# EAGLE design Transistor Tester v3 (EAGLE 6.5.0)
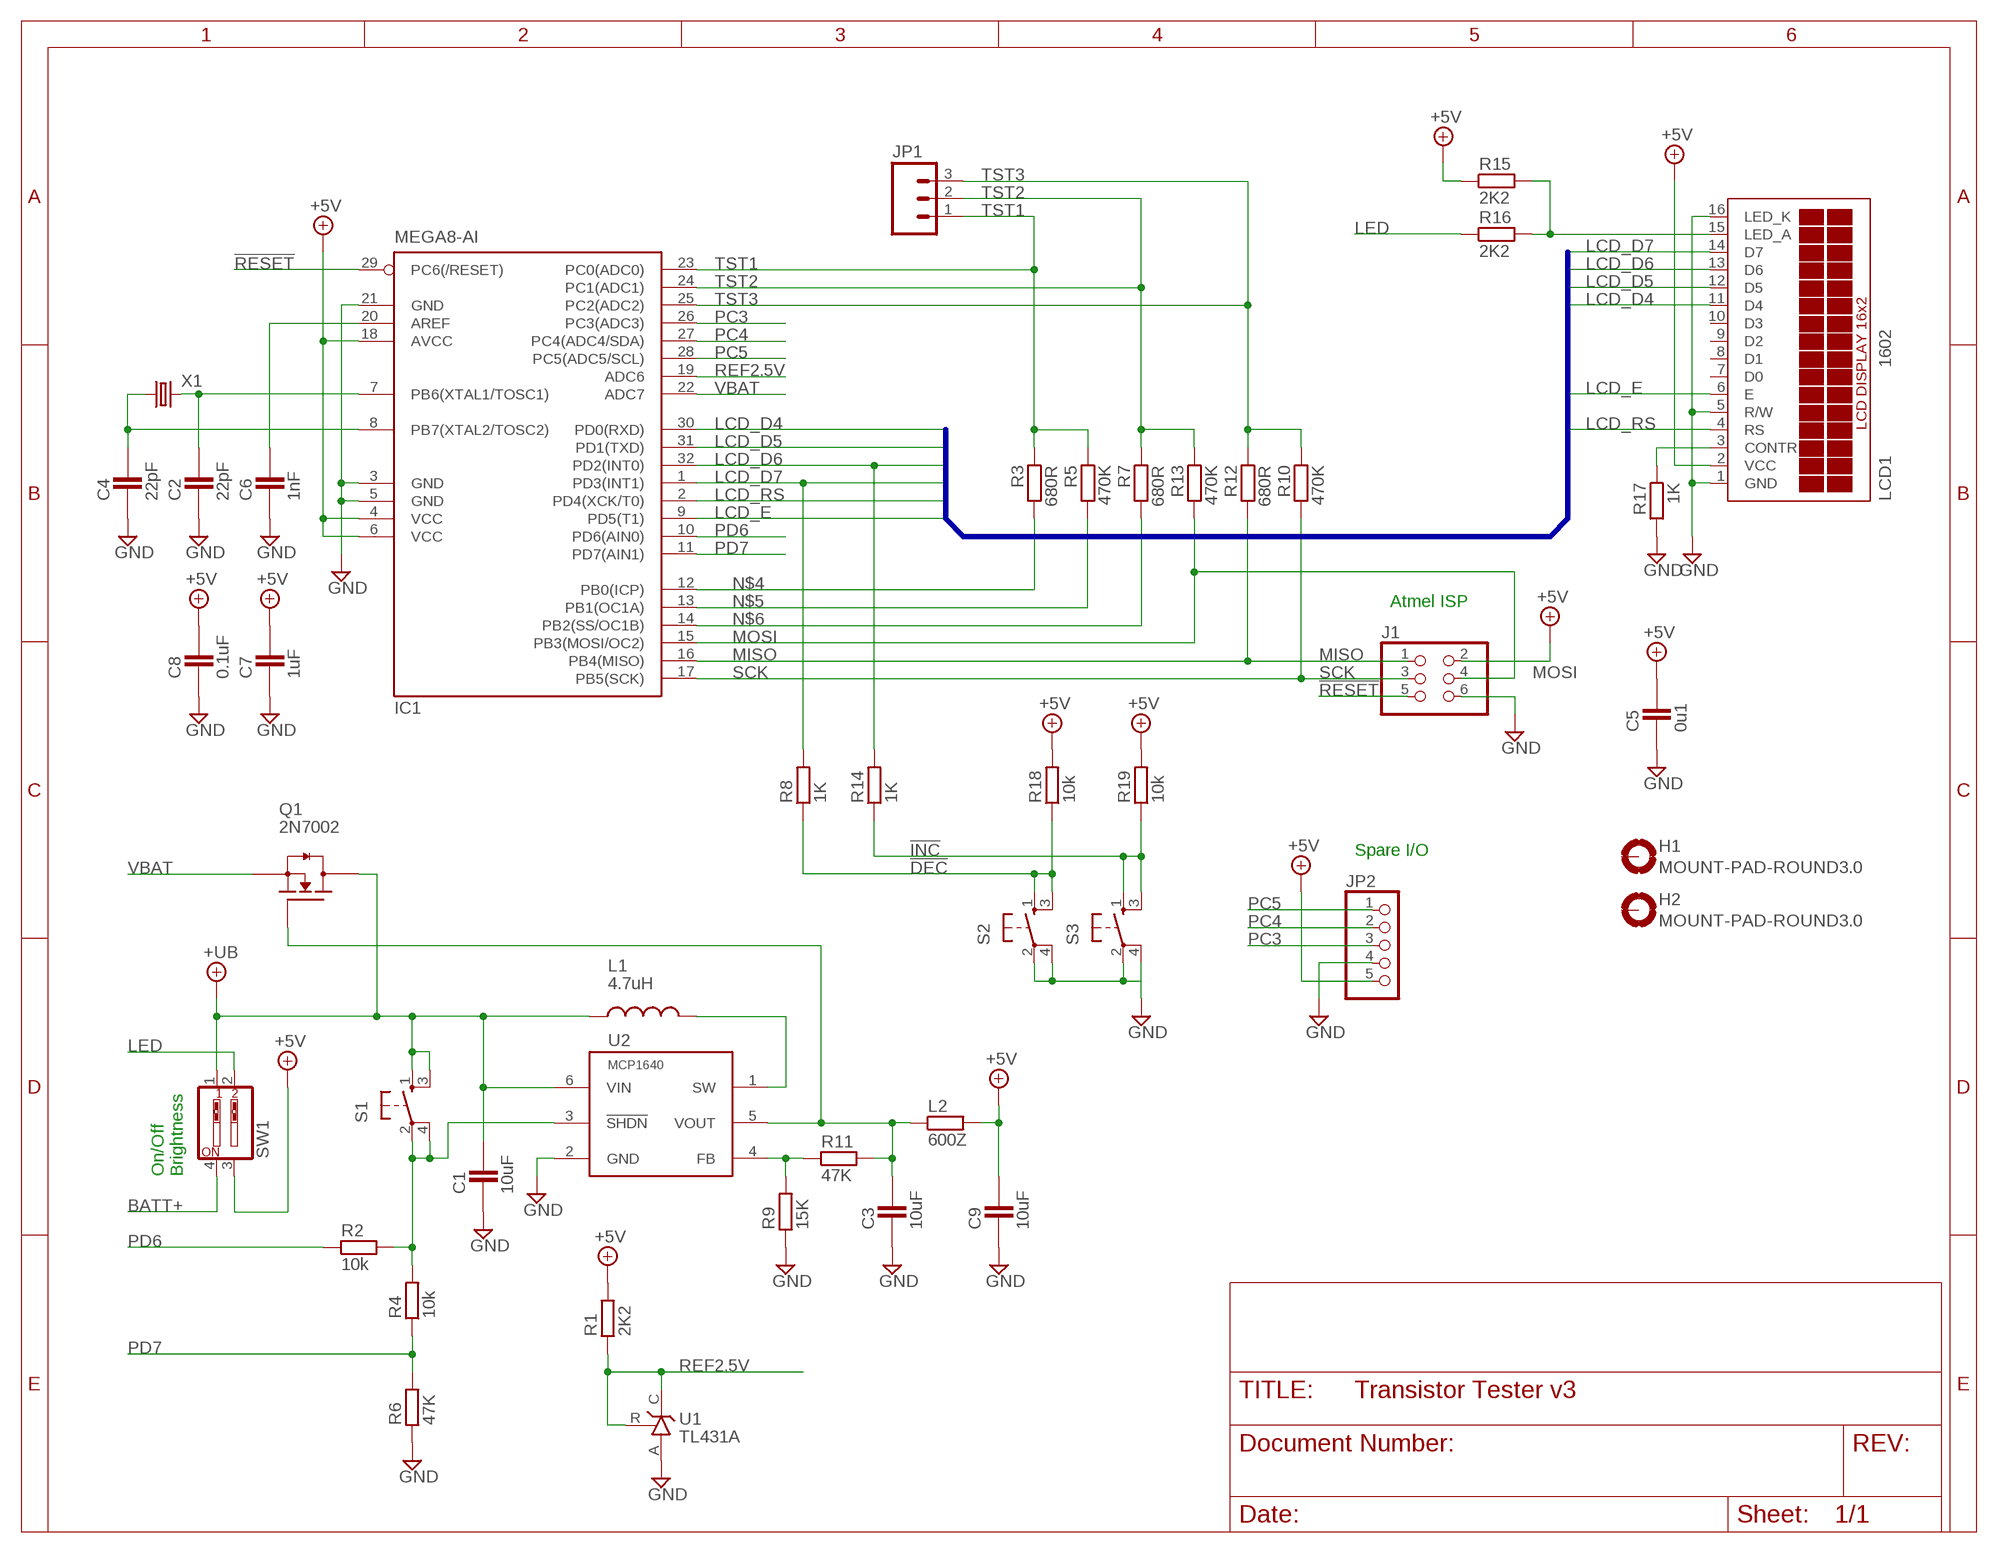
[diagram p0: schematic, sheet 1]

## Parts
C1  10uF  CAPACITOR_0805  [CAPC2012X145AN]
C2  22pF  CAPACITOR_0603  [CAPC1608X92N]
C3  10uF  CAPACITOR_0805  [CAPC2012X145AN]
C4  22pF  CAPACITOR_0603  [CAPC1608X92N]
C5  0u1  CAPACITOR_0603  [CAPC1608X92N]
C6  1nF  CAPACITOR_0603  [CAPC1608X92N]
C7  1uF  CAPACITOR_0603  [CAPC1608X92N]
C8  0.1uF  CAPACITOR_0603  [CAPC1608X92N]
C9  10uF  CAPACITOR_0805  [CAPC2012X145AN]
H1  MOUNT-PAD-ROUND3.0  [3,0-PAD]
H2  MOUNT-PAD-ROUND3.0  [3,0-PAD]
IC1  MEGA8-AI  [TQFP32-08]
J1  PINHD-2X3_2.54  [2X03]
JP1  M03POLAR  [MOLEX-1X3]
JP2  PINHD-1X5  [1X05]
L1  4.7uH  CD43  [CD43]
L2  600Z  RESISTOR_0805  [RESC2012X70N]
LCD1  1602  TUXGR_16X2_R2NOMOUNT  [TUXGR_16X2_R2_NM]
Q1  2N7002  MOSFET-NCH_SOT-23  [SOT95P280X135-3N]
R1  2K2  RESISTOR_0603  [RESC1608X55N]
R2  10k  RESISTOR_0603  [RESC1608X55N]
R3  680R  RESISTOR_0603  [RESC1608X55N]
R4  10k  RESISTOR_0603  [RESC1608X55N]
R5  470K  RESISTOR_0603  [RESC1608X55N]
R6  47K  RESISTOR_0603  [RESC1608X55N]
R7  680R  RESISTOR_0603  [RESC1608X55N]
R8  1K  RESISTOR_0603  [RESC1608X55N]
R9  15K  RESISTOR_0603  [RESC1608X55N]
R10  470K  RESISTOR_0603  [RESC1608X55N]
R11  47K  RESISTOR_0603  [RESC1608X55N]
R12  680R  RESISTOR_0603  [RESC1608X55N]
R13  470K  RESISTOR_0603  [RESC1608X55N]
R14  1K  RESISTOR_0603  [RESC1608X55N]
R15  2K2  RESISTOR_0603  [RESC1608X55N]
R16  2K2  RESISTOR_0603  [RESC1608X55N]
R17  1K  RESISTOR_0603  [RESC1608X55N]
R18  10k  RESISTOR_0603  [RESC1608X55N]
R19  10k  RESISTOR_0603  [RESC1608X55N]
S1  MOM_SWTH  [MOM_SW]
S2  MOM_SWTH  [MOM_SW]
S3  MOM_SWTH  [MOM_SW]
SW1  SW_DIP-2  [EDG-02]
U1  TL431A  TL_431LP  [TO92-CLP]
U2  MCP1640  BOOST-MCP1624T-I/CHY  [SOT26]
X1  CRYSTALHC49UP  [HC49UP]

## Nets
!DEC: R8.1 R18.1 S2.1 S2.3
!INC: R14.1 R19.1 S3.1 S3.3
!RESET: IC1.29(PC6(/RESET)) J1.5
!SHUTDN: R2.2 R4.2 S1.2 S1.4 U2.3(!SHDN)
+5V: C5.2 C7.2 C8.2 C9.2 IC1.4(VCC) IC1.6(VCC) IC1.18(AVCC) J1.2 JP2.5 L2.2 LCD1.2(VCC) R1.2 R15.1 R18.2 R19.2 SW1.3
+UB: C1.2 L1.1 Q1.3(D) S1.1 S1.3 SW1.1 U2.6(VIN)
BATT+: SW1.4
GND: C1.1 C2.1 C3.1 C4.1 C5.1 C6.1 C7.1 C8.1 C9.1 IC1.3(GND) IC1.5(GND) IC1.21(GND) J1.6 JP2.4 LCD1.1(GND) LCD1.5(R/W) LCD1.16(LED_K) R6.1 R9.1 R17.2 S2.2 S2.4 S3.2 S3.4 U1.A U2.2(GND)
LCD_A: LCD1.15(LED_A) R15.2 R16.2
LCD_D4: IC1.30(PD0(RXD)) LCD1.11(D4)
LCD_D5: IC1.31(PD1(TXD)) LCD1.12(D5)
LCD_D6: IC1.32(PD2(INT0)) LCD1.13(D6) R14.2
LCD_D7: IC1.1(PD3(INT1)) LCD1.14(D7) R8.2
LCD_E: IC1.9(PD5(T1)) LCD1.6(E)
LCD_RS: IC1.2(PD4(XCK/T0)) LCD1.4(RS)
LED: R16.1 SW1.2
MISO: IC1.16(PB4(MISO)) J1.1 R12.2
MOSI: IC1.15(PB3(MOSI/OC2)) J1.4 R13.2
N$1: C4.2 IC1.8(PB7(XTAL2/TOSC2)) X1.1
N$2: L1.2 U2.1(SW)
N$3: C3.2 L2.1 Q1.1(G) R11.2 U2.5(VOUT)
N$4: IC1.12(PB0(ICP)) R3.2
N$5: IC1.13(PB1(OC1A)) R5.2
N$6: IC1.14(PB2(SS/OC1B)) R7.2
N$7: R9.2 R11.1 U2.4(FB)
N$8: C2.2 IC1.7(PB6(XTAL1/TOSC1)) X1.2
N$9: C6.2 IC1.20(AREF)
N$27: LCD1.3(CONTR) R17.1
PC3: IC1.26(PC3(ADC3)) JP2.3
PC4: IC1.27(PC4(ADC4/SDA)) JP2.2
PC5: IC1.28(PC5(ADC5/SCL)) JP2.1
PD6: IC1.10(PD6(AIN0)) R2.1
PD7: IC1.11(PD7(AIN1)) R4.1 R6.2
REF2.5V: IC1.19(ADC6) R1.1 U1.C U1.R
SCK: IC1.17(PB5(SCK)) J1.3 R10.2
TST1: IC1.23(PC0(ADC0)) JP1.1 R3.1 R5.1
TST2: IC1.24(PC1(ADC1)) JP1.2 R7.1 R13.1
TST3: IC1.25(PC2(ADC2)) JP1.3 R10.1 R12.1
VBAT: IC1.22(ADC7) Q1.2(S)
Unconnected: H1.B3,0(MOUNT) H2.B3,0(MOUNT) LCD1.7(D0) LCD1.8(D1) LCD1.9(D2) LCD1.10(D3)

## Buses
B$1

## Notes on the sheet
- Atmel ISP
- Spare I/O
- On/Off
  Brightness

## Library data of the parts
C1-C9 = ipc-7351-capacitor:CAPACITOR_
H1 H2 = holes:MOUNT-PAD-ROUND: MOUNTING PAD, round
IC1 = atmel:MEGA8: MICROCONTROLLER 8 Kbytes FLASH, 1 kbytes SRAM, 512 bytes EEPROM, USART, 6-channel 10 bit ADC, 2-channel 8 bit ADC Pin compatible with Atmega48, ATMega88, ATMega168 Source: avr.lbr; MPN: ATMEGA8-16AU; OC_FARNELL: 9171371; OC_NEWARK: 73M8863
J1 = Misc Conn:PINHD-2X3: PIN HEADER
JP1 = SparkFun-Connectors:M03: Header 3 Standard 3-pin 0.1" header. Use with straight break away headers (SKU : PRT-00116), right angle break away headers (PRT-00553), swiss pins (PRT-00743), machine pins (PRT-00117), and female headers (PRT-00115). Molex polarized connector foot print use with SKU : PRT-08232 with associated crimp pins and housings.
JP2 = pinhead:PINHD-1X5: PIN HEADER
L1 = Misc Inductors:CD
L2 R1-R19 = ipc-7351-resistor:RESISTOR_
LCD1 = Misc opto:TUXGR_16X2_R2: Tuxgraphics LCD display 16x2 characters reflective, without background light Source: tuxgr_12x2_r2.pdf; OC_FARNELL: unknown; OC_NEWARK: unknown
Q1 = ipc-7351-transistor:MOSFET-NCH_
S1-S3 = Misc Passives:MOM_SW: Tact Switch
SW1 = special:SW_DIP-2: DIP SWITCH
U1 = Misc Analog:TL_431: Voltage Reference 1.24V TI TL431, ST3431
U2 = Misc Power:BOOST-
X1 = Misc Passives:CRYSTAL: CRYSTAL

## Net classes
1 diff: width 0.003 mm, drill 0.006 mm, clearance 0.007 mm

## Board
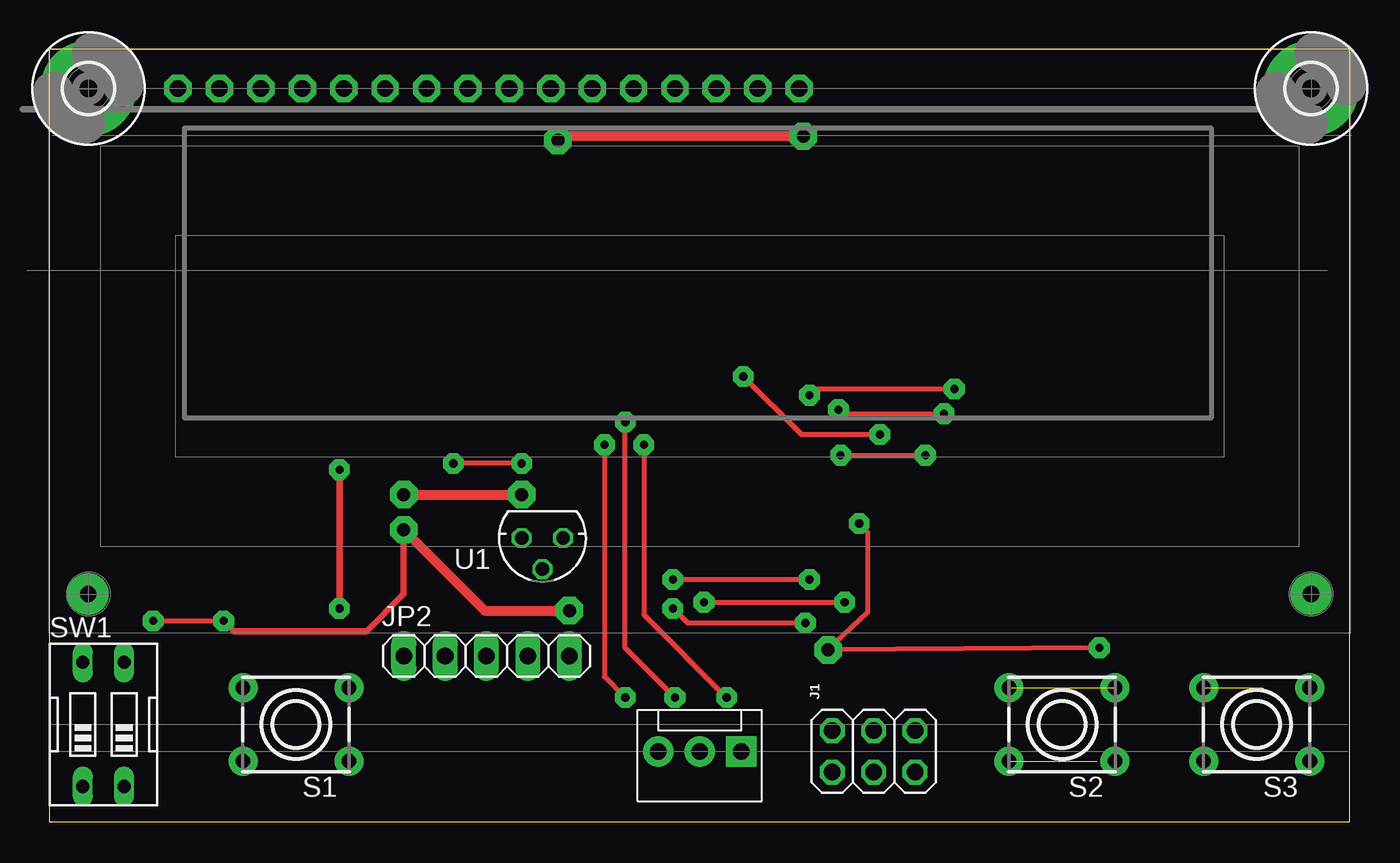
[diagram p1: board, top side]
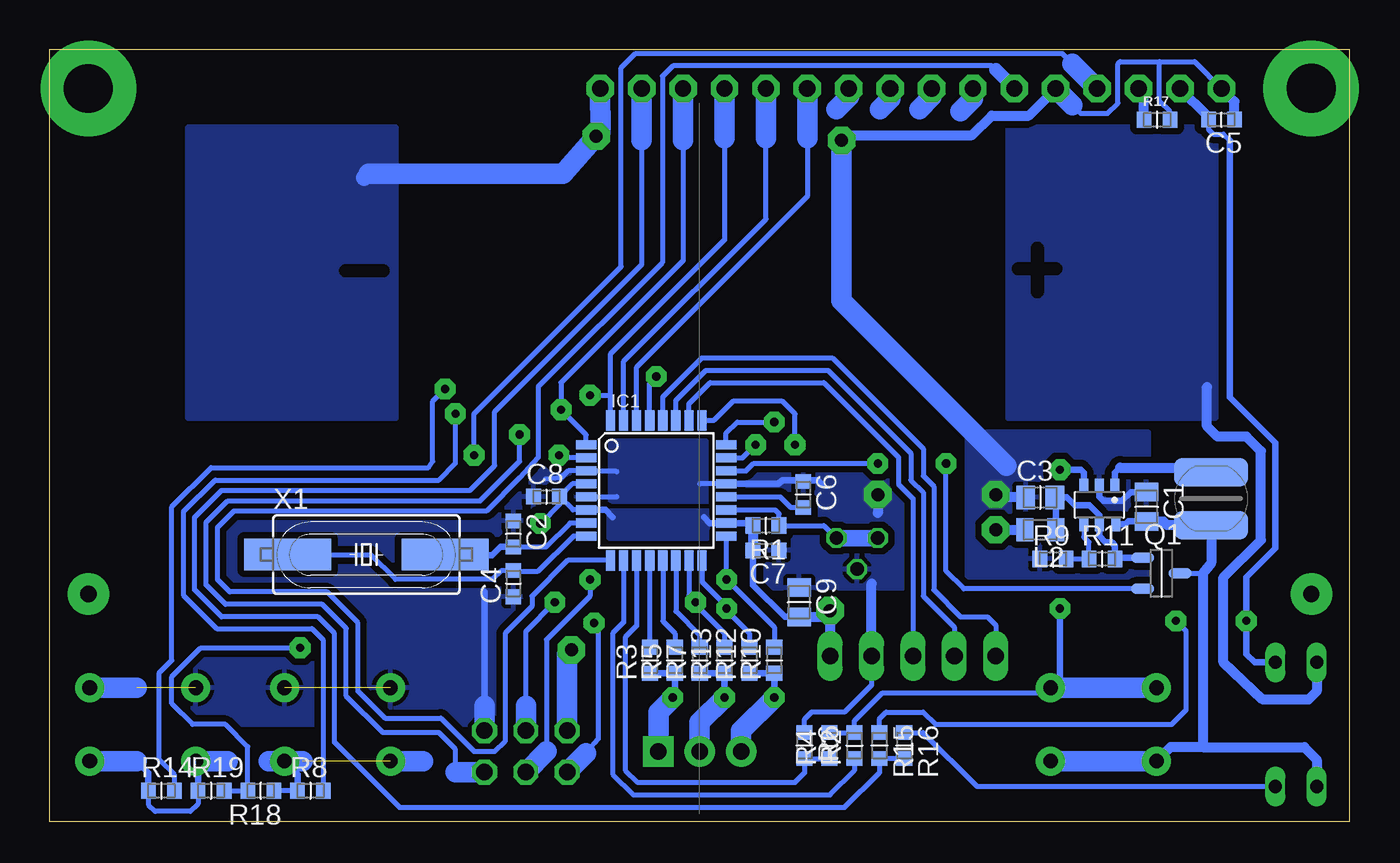
[diagram p2: board, bottom side, seen from below]

Size 79.76 x 47.37 mm. Coordinates in mm from the lower left corner, seen from the top.
Outline: 0,0 79.76,0 79.76,47.37 0,47.37 0,0
Copper layers (1*16): Top 0.035559375mm / dielectric 1.6mm / Bottom 0.035559375mm
Design rules "oshpark-2layer": minimum track width 6mil, minimum drill 10mil, track to track 6mil, track to pad 6mil, pad to pad 6mil, via to via 6mil, smd to smd 6mil, copper to edge 15mil, drill to drill 6mil, minimum pad ring 5mil, minimum via ring 5mil, stop-mask expansion 2.5mil, vias tented up to drill 0mil, thermal gap 10mil
bRestrict: 3 lines

### Footprints (pad centres in the part's own frame; a part is rotated, then mirrored left to right if it is on the bottom)
CAPC2012X145AN = smd 1.15 x 1.45: 1 -0.9,0; 2 0.9,0
CAPC1608X92N = smd 0.9 x 0.95: 1 -0.8,0; 2 0.8,0
3,0-PAD = drill 3 pad 5.842: B3,0 0,0
TQFP32-08 = smd 1.27 x 0.559: 1 -4.293,2.8; 2 -4.293,2; 3 -4.293,1.2; 4 -4.293,0.4; 5 -4.293,-0.4; 6 -4.293,-1.2; 7 -4.293,-2; 8 -4.293,-2.8; 17 4.293,-2.8; 18 4.293,-2; 19 4.293,-1.2; 20 4.293,-0.4; 21 4.293,0.4; 22 4.293,1.2; 23 4.293,2; 24 4.293,2.8 | smd 0.559 x 1.27: 9 -2.8,-4.293; 10 -2,-4.293; 11 -1.2,-4.293; 12 -0.4,-4.293; 13 0.4,-4.293; 14 1.2,-4.293; 15 2,-4.293; 16 2.8,-4.293; 25 2.8,4.293; 26 2,4.293; 27 1.2,4.293; 28 0.4,4.293; 29 -0.4,4.293; 30 -1.2,4.293; 31 -2,4.293; 32 -2.8,4.293
2X03 = drill 1.016 octagon: 1 -2.54,-1.27; 2 -2.54,1.27; 3 0,-1.27; 4 0,1.27; 5 2.54,-1.27; 6 2.54,1.27
MOLEX-1X3 = drill 1.016 pad 1.88 square: 1 0,0 | drill 1.016 pad 1.88: 2 2.54,0; 3 5.08,0
1X05 = drill 1.016 long: 1 -5.08,0; 2 -2.54,0; 3 0,0; 4 2.54,0; 5 5.08,0
CD43 = smd 4.5 x 1.75: 1 0,1.625; 2 0,-1.625
RESC2012X70N = smd 1.05 x 1.4: 1 -0.95,0; 2 0.95,0
TUXGR_16X2_R2_NM = drill 1 pad 1.676 octagon: 1 -32,15.5; 2 -29.46,15.5; 3 -26.92,15.5; 4 -24.38,15.5; 5 -21.84,15.5; 6 -19.3,15.5; 7 -16.76,15.5; 8 -14.22,15.5; 9 -11.68,15.5; 10 -9.14,15.5; 11 -6.6,15.5; 12 -4.06,15.5; 13 -1.52,15.5; 14 1.02,15.5; 15 3.56,15.5; 16 6.1,15.5
SOT95P280X135-3N = smd 1.4 x 0.65: 1 -1.15,0.95; 2 -1.15,-0.95; 3 1.15,0
RESC1608X55N = smd 0.9 x 1: 1 -0.8,0; 2 0.8,0
MOM_SW = drill 0.9 pad 1.778: 1 -2.25,3.25; 2 2.25,3.25; 3 -2.25,-3.25; 4 2.25,-3.25
EDG-02 = drill 0.813 long: 1 -1.27,-3.81; 2 1.27,-3.81; 3 1.27,3.81; 4 -1.27,3.81
TO92-CLP = drill 0.813 octagon: A 0,1.905; C 1.27,0; R -1.27,0
SOT26 = smd 0.55 x 0.8: 1 -0.95,-1.2; 2 0,-1.2; 3 0.95,-1.2; 4 0.95,1.2; 5 0,1.2; 6 -1,1.2
HC49UP = smd 5.334 x 1.93: 1 -4.826,0; 2 4.826,0

### Placement (x,y rotation side)
C1  12.47,19.32 270 bottom
C2  51.31,17.65 270 bottom
C3  18.99,19.89 0 bottom
C4  51.31,14.61 90 bottom
C5  7.87,43.05 180 bottom
C6  33.53,20.07 270 bottom
C7  35.81,16.64 180 bottom
C8  49.28,19.94 0 bottom
C9  33.78,13.46 270 bottom
H1  2.37,44.97 0 top
H2  77.38,44.97 0 top
IC1  42.55,20.32 0 bottom
J1  50.55,4.32 0 top
JP1  42.42,4.32 180 top
JP2  26.8,10.16 0 top
L1  8.51,19.81 180 bottom
L2  18.99,17.91 180 bottom
LCD1  39.88,29.46 0 top
Q1  11.56,15.24 0 bottom
R1  35.81,18.16 180 bottom
R2  30.39,4.67 90 bottom
R3  42.93,9.91 90 bottom
R4  31.92,4.67 90 bottom
R5  41.4,9.91 90 bottom
R6  33.45,4.67 270 bottom
R7  39.88,9.91 90 bottom
R8  63.75,1.91 0 bottom
R9  18.21,16.12 0 bottom
R10  35.31,9.91 90 bottom
R11  15.2,16.12 0 bottom
R12  36.83,9.91 90 bottom
R13  38.35,9.91 90 bottom
R14  72.9,1.91 0 bottom
R15  28.85,4.67 270 bottom
R16  27.33,4.67 270 bottom
R17  11.82,43.05 0 bottom
R18  66.8,1.91 180 bottom
R19  69.85,1.91 0 bottom
S1  15.11,5.97 90 top
S2  62.1,5.97 90 top
S3  74.04,5.97 90 top
SW1  3.3,5.97 0 top
U1  30.23,17.4 180 top
U2  15.37,19.43 180 bottom
X1  60.33,16.38 0 bottom

### Tracks (layer width: path | path; a pad name or v marks a point on that pad's centre or on a via)
!DEC  (1 unrouted)
  Bottom 0.305: R8.1 R18.1
  Bottom 0.406: R8.1 64.55,2.92 S2.3
  Bottom 1.27: S2.1 56.86,3.72 | 64.23,3.72 S2.3 66.33,3.72
!INC
  Bottom 0.305: R19.1 70.65,1.1 71.12,0.64 73.28,0.64 73.7,1.05 R14.1
  Bottom 0.406: R19.1 70.65,3.58 S3.1 | R14.1 73.7,3 74.42,3.72
  Bottom 1.27: S3.3 74.42,3.72 | S3.1 68.83,3.72
!RESET  (via drill 0.5 pad 1.27)
  Top 0.305: v42.55,27.3 46.1,23.75 v50.93,23.75
  Bottom 0.305: IC1.29 42.95,26.91 v42.55,27.3 | 54.86,3.05 54.86,4.45 55.88,5.46 59.31,5.46 61.56,7.71 61.56,11.86 63.03,13.34 68.96,13.34 70.16,14.53 70.16,18.36 68.83,19.68 53.34,19.68 50.93,22.1 v50.93,23.75 50.93,23.88
  Bottom 1.27: J1.5 54.86,3.05
!SHUTDN  (via drill 0.5 pad 1.27)
  Top 0.406: v17.78,13.08 v17.78,21.59
  Bottom 0.305: R4.2 R2.2 | R2.2 30.37,5.47 30.35,5.46 | R2.2 30.39,6.18 28.7,7.87 18.71,7.87 S1.4
  Bottom 0.406: U2.3 16.32,21.4 16.51,21.59 v17.78,21.59 | v17.78,13.08 17.78,8.8 S1.4
  Bottom 1.27: S1.2 S1.4
+5V  (via drill 0.5 pad 1.27, 0.8 pad 1.68)
  Top 0.305: v49.66,18.29 50.16,17.78 50.16,12.83 v47.75,10.54 v64.39,10.67 | v6.35,12.32 v10.67,12.32
  Top 0.406: v21.72,17.91 21.72,13.97 19.43,11.68 11.3,11.68 v10.67,12.32
  Top 0.61: v21.72,17.91 26.67,12.95 v31.88,12.95
  Bottom 0.305: IC1.4 47.7,20.72 C8.2 | IC1.6 47.66,19.12 C8.2 | C5.2 8.67,42.46 8.38,42.16 7.75,42.16 7.37,41.78 | C8.2 48.48,19.47 v49.66,18.29 | R15.1 28.85,6.33 28.45,6.73 26.16,6.73 25.4,5.97 10.92,5.97 10.03,6.86 10.03,11.68 v10.67,12.32 | R19.2 R18.2 67.6,4.61 68.96,5.97 70.99,5.97 72.26,7.24 72.26,8.89 70.48,10.67 v64.39,10.67
  Bottom 0.406: 39.62,18.67 39.27,18.32 IC1.18 36.77,18.32 R1.2 | IC1.6 45.66,19.12 45.21,18.67 | 7.37,41.78 7.37,26.04 4.57,23.24 4.57,16.76 6.35,14.99 v6.35,12.32 6.35,10.29 5.84,9.78 SW1.3 | C7.2 36.61,14.52 34.66,12.56 C9.2 33.77,12.57
  Bottom 0.61: R1.2 C7.2 | C5.2 8.67,43.22 LCD1.2 | JP2.5 v31.88,12.95 32.26,12.57 33.77,12.57 | v21.72,17.91 L2.2
  Bottom 1.27: J1.2 48.01,10.29 v47.75,10.54
  pour Bottom (isolate 0.406): 39.37,19.05 45.47,19.05 45.47,17.4 39.37,17.4
+UB
  Bottom 0.305: Q1.3 9.02,15.24
  Bottom 0.406: U2.6 13.77,18.23 13.59,18.41 C1.2
  Bottom 0.61: C1.2 11.43,18.42 11.2,18.19 L1.1 8.51,15.88 9.02,15.24 9.02,4.57 | 9.02,4.57 2.79,4.57 2.03,3.81 SW1.1 | 9.02,4.57 11.01,4.57 S1.1
  Bottom 1.27: S1.1 S1.3
BATT+
  Bottom 0.61: SW1.4 2.03,8 2.54,7.49 5.33,7.49 7.75,9.78 7.75,14.99 5.46,17.27 5.46,22.73 6.35,23.62 8.13,23.62 8.76,24.26 8.76,26.67
  pour Bottom (isolate 0.406): 8.26,42.55 20.95,42.55 20.95,24.77 8.26,24.77
GND  (via drill 0.8 pad 1.68)  (2 unrouted)
  Top 0.61: v46.23,42.03 31.18,42.03 v31.18,41.78 | v21.72,20.07 v28.96,20.07
  Bottom 0.305: LCD1.1 9.52,46.61 11.68,46.61 | IC1.5 44.98,19.92 44.96,19.94 | 44.96,21.46 45.02,21.52 IC1.3 47.95,21.52 48.39,21.08 49.35,21.01 | IC1.21 39.86,20.72 39.88,20.7 | R17.2 11.02,43.54 11.68,44.2 11.68,46.61 | LCD1.5 | 17.02,43.94 16.51,43.43 14.86,43.43 14.22,44.07 14.22,46.48 14.1,46.61 11.68,46.61 | JP2.4 29.34,8.38 30.99,6.73 33.02,6.73 33.45,6.3 R6.1
  Bottom 0.406: IC1.21 35.03,20.72 34.8,20.95 32.64,20.95 32.35,20.66 | C1.1 13.44,20.22 13.97,19.68 15.11,19.68 15.37,19.94 U2.2 | 53.09,7.11 53.09,14.1
  Bottom 0.61: C5.1 7.07,44.16 LCD1.1 | v31.18,41.78 31.18,42.1 23.18,42.1 21.97,43.31 19.7,43.31 LCD1.5 | JP2.4 29.34,14.61 | C3.1 21.4,19.89 v21.72,20.07 | v28.96,20.07 28.96,18.92
  Bottom 1.016: 60.2,39.75 60.45,39.5
  Bottom 1.27: LCD1.16 45.97,42.29 v46.23,42.03 48.26,39.75 60.2,39.75 | LCD1.5 17.02,43.94 | v31.18,41.78 31.18,31.94 21.08,21.84 | J1.6 53.09,7.11 | S3.4 74.42,8.22
  pour Bottom (isolate 0.406): 58.55,24.77 71.25,24.77 71.25,42.55 58.55,42.55
  pour Bottom (isolate 0.305, rank 5): 39.5,23.37 39.5,19.05 45.34,19.05 45.34,23.37
  pour Bottom (isolate 0.406, rank 6): 47.12,21.84 71.12,21.84 71.12,5.97 46.99,5.97
  pour Bottom (isolate 0.406, rank 6): 27.05,21.97 36.96,21.84 36.96,14.35 27.05,14.35
  pour Bottom (isolate 0.406, rank 6): 12.32,23.88 23.5,23.88 23.5,14.99 12.32,14.99
LCD_A
  Bottom 0.305: 43.43,41.78 43.43,34.16 52.45,25.15 52.45,21.84 53.98,20.32 69.22,20.32 70.87,18.67 70.87,14.22 69.22,12.57 63.3,12.57 62.28,11.56 62.28,4.88 58.29,0.89 30.99,0.89 28.85,3.02 R15.2 R16.2
  Bottom 1.27: LCD1.15 43.44,41.79 43.43,41.78
LCD_D4
  Bottom 0.305: IC1.30 43.74,27.88 33.28,38.35 33.28,41.91
  Bottom 1.27: LCD1.11 33.28,41.91
LCD_D5
  Bottom 0.305: IC1.31 44.55,28.23 35.81,36.96 35.81,41.91
  Bottom 1.016: LCD1.12
  Bottom 1.27: 35.81,41.91 LCD1.12
LCD_D6  (via drill 0.5 pad 1.27)
  Top 0.305: v46.61,26.16 46.61,26.29 46.86,26.54 v55.5,26.54
  Bottom 0.305: IC1.32 45.34,26.11 | 45.34,26.11 45.34,28.7 38.35,35.69 38.35,41.91 | 45.34,26.11 46.56,26.11 v46.61,26.16 | v55.5,26.54 56.26,25.78 56.26,22.1 56.52,21.72 69.85,21.72 72.26,19.3 72.26,9.91 73.03,9.14 73.03,3.81 72.1,2.88 R14.2
  Bottom 1.016: 38.36,41.91 38.35,41.91
  Bottom 1.27: LCD1.13 38.36,41.91
LCD_D7  (via drill 0.5 pad 1.27)
  Top 0.305: v48.39,25.27 48.64,25.02 v54.86,25.02
  Bottom 0.305: 40.89,41.78 40.89,34.42 48.39,26.92 v48.39,25.27 46.84,23.72 IC1.1 | v54.86,25.02 54.86,21.97 55.88,20.95 69.6,20.95 71.55,19 71.55,13.89 69.51,11.85 63.66,11.85 62.99,11.18 62.99,1.94 R8.2
  Bottom 1.016: 40.9,41.79 40.89,41.78
  Bottom 1.27: LCD1.14 40.9,41.79
LCD_E
  Bottom 0.305: 21.72,46.1 21.97,46.35 41.53,46.35 42.16,45.72 42.16,34.29 49.78,26.67 49.78,22.35 50.93,21.08 52.96,19.05 68.45,19.05 69.47,18.03 69.47,14.86 68.71,14.1 62.74,14.1 60.83,12.19 60.83,8 59.18,6.35 55.75,6.35 53.72,4.32 52.45,4.32 51.82,4.95 51.82,11.56 50.16,13.21 50.16,13.84 47.98,16.03 IC1.9
  Bottom 0.813: 21.72,46.1 LCD1.6
LCD_RS  (via drill 0.5 pad 1.27)
  Top 0.305: v48.51,22.48 v53.72,22.48
  Bottom 0.305: IC1.2 48.48,22.32 v48.51,22.48 | 17.02,46.49 17.27,46.74 17.65,47.12 43.81,47.12 44.7,46.23 44.7,34.04 53.72,25.02 v53.72,22.48
  Bottom 1.27: 17.02,46.49 LCD1.4
LED
  Bottom 0.305: SW1.2 22.86,2.16 26.18,5.47 R16.1
MISO  (via drill 0.5 pad 1.27)
  Top 0.305: v38.23,13.08 39.12,12.19 v46.35,12.19
  Bottom 0.305: R12.2 36.83,11.56 38.35,13.08 v38.23,13.08 38.23,13.21 39.74,14.73 IC1.16 | 46.86,4.19 46.35,4.83 46.1,5.08 46.1,11.81 v46.35,12.19
  Bottom 1.27: J1.1 46.86,4.19
MOSI  (via drill 0.5 pad 1.27)
  Top 0.305: v40.13,13.46 v48.77,13.46
  Bottom 0.305: IC1.15 40.55,13.88 v40.13,13.46 40.13,13.34 38.35,11.56 R13.2 | 50.55,7.11 50.55,11.68 v48.77,13.46
  Bottom 1.27: J1.4 50.55,7.11
N$1
  Bottom 0.305: IC1.8 47.63,17.52 49.78,15.37 51.27,15.37 C4.2 52.03,15.4 52.58,14.86 58.55,14.86 60.07,16.38 X1.1
N$2
  Bottom 0.406: U2.1 14.42,21.4 14.1,21.72
  Bottom 0.61: 14.1,21.72 8.79,21.72 L1.2
N$3
  Bottom 0.406: Q1.1 14.33,16.19 R11.2 14.4,16.94 14.61,17.14 14.99,17.14 15.37,17.53 U2.5 15.37,18.8 15.98,19.41 16.87,19.41 17.35,19.89 C3.2 18.04,19.84 L2.1
N$4
  Bottom 0.305: IC1.12 42.95,10.72 R3.2
N$5
  Bottom 0.305: IC1.13 42.15,12.3 41.4,11.56 R5.2
N$6
  Bottom 0.305: IC1.14 41.34,12.9 39.88,11.43 R7.2
N$7
  Bottom 0.305: U2.4 16.32,17.46 16,17.14 R11.1 R9.2
N$8
  Bottom 0.305: IC1.7 47.85,18.32 49.31,16.85 C2.2
  Bottom 0.406: C2.2 52.11,16.85 52.62,16.34 56.1,16.34 X1.2
N$9
  Bottom 0.305: IC1.20 34.94,19.92 34.29,19.27 C6.2
N$10
  Bottom 1.27: 23.11,44.96 23.11,44.32 23.88,43.56
N$11  (via drill 1 pad 2.54)
  other vias: 2.36,13.98
N$12  (via drill 1 pad 2.54)
  other vias: 77.37,13.96
N$13
  Bottom 1.27: 25.65,44.96 25.65,44.45 26.42,43.69
N$14
  Bottom 1.27: 28.19,44.96 28.19,44.32 28.83,43.69
N$15
  Bottom 1.27: 30.73,44.96 30.73,44.45 31.5,43.69
N$27
  Bottom 0.61: R17.1 12.62,44.63 LCD1.3
PC3
  Bottom 0.305: JP2.3 26.8,19.81 27.69,20.7 27.69,22.35 32.26,26.92 39.24,26.92 40.55,25.62 IC1.26
PC4
  Bottom 0.305: IC1.27 41.34,25.84 39.5,27.69 32,27.69 26.92,22.61 26.92,20.95 26.16,20.19 26.16,13.84 24.26,11.94 JP2.2
PC5
  Bottom 0.305: IC1.28 42.15,26.05 39.75,28.45 31.75,28.45 26.16,22.86 26.16,21.21 25.53,20.57 25.53,14.22 23.88,12.57 22.23,12.57 21.72,12.06 JP2.1
PD6
  Bottom 0.305: IC1.10 44.55,12.22 45.21,11.56 45.21,2.92 43.94,1.65 31.88,1.65 30.39,3.14 R2.1
PD7
  Bottom 0.305: IC1.11 43.74,12.01 44.45,11.3 44.45,3.17 43.69,2.41 34.04,2.41 33.45,3 R6.2 R4.1
REF2.5V
  Bottom 0.305: IC1.19 35.25,19.12 35.01,18.89 R1.1 32.26,18.16 U1.R
  Bottom 1.016: U1.R U1.C
SCK  (via drill 0.5 pad 1.27)
  Top 0.305: v38.23,14.86 v46.61,14.86
  Bottom 0.305: IC1.17 38.25,14.88 v38.23,14.86 35.31,11.94 R10.2 | v46.61,14.86 46.61,13.84 49.28,11.18 49.28,4.32
  Bottom 1.27: J1.3 49.28,4.32
TST1  (via drill 0.5 pad 1.27)
  Top 0.305: v36.45,23.11 36.45,12.7 v41.53,7.62
  Bottom 0.305: IC1.23 37.24,22.32 v36.45,23.11
  Bottom 0.406: R3.1 R5.1 41.4,7.87 v41.53,7.62
  Bottom 1.27: JP1.1 42.42,6.73 v41.53,7.62
TST2  (via drill 0.5 pad 1.27)
  Top 0.305: v38.35,7.62 35.31,10.67 v35.31,24.51
  Bottom 0.305: IC1.24 38.25,23.85 37.59,24.51 v35.31,24.51
  Bottom 0.406: v38.35,7.62 R13.1 R7.1
  Bottom 1.27: JP1.2 39.88,6.1 v38.35,7.62
TST3  (via drill 0.5 pad 1.27)
  Top 0.305: v34.04,23.11 34.04,8.89 v35.31,7.62
  Bottom 0.305: v35.31,7.62 R10.1 | v34.04,23.11 34.04,25.02 34.8,25.78 37.85,25.78 39.01,24.61 IC1.25
  Bottom 0.406: R10.1 R12.1 | v35.31,7.62 35.31,9.14
  Bottom 1.27: JP1.3 37.34,5.59 v35.31,7.62
VBAT  (via drill 0.5 pad 1.27)
  Top 0.305: v28.96,21.97 v24.77,21.97
  Bottom 0.305: IC1.22 37.03,21.52 36.58,21.97 v28.96,21.97 | Q1.2 23.69,14.29 24.77,15.37 v24.77,21.97